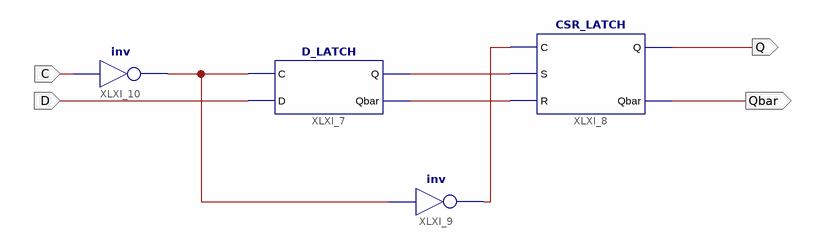
[diagram p0: schematic sheet 1]
// Xilinx ISE schematic D_FLIPFLOP.sch (kintex7) as structural Verilog: 4 symbols, 4 ports
module D_FLIPFLOP (
  input  D,
  input  C,
  output Q,
  output Qbar
);

  wire XLXN_14, XLXN_15, XLXN_16, XLXN_18;

  D_LATCH XLXI_7 (.C(XLXN_16), .D(D), .Q(XLXN_14), .Qbar(XLXN_15));
  CSR_LATCH XLXI_8 (.C(XLXN_18), .S(XLXN_14), .R(XLXN_15), .Q(Q), .Qbar(Qbar));
  not XLXI_9 (XLXN_18, XLXN_16);
  not XLXI_10 (XLXN_16, C);
endmodule
